# EasyEDA Pro project ProPrj_FK407M3-VET6-V1.1-LCD-EB_2024-10-31.epro

# Schematic Schematic1
Board Name: Board1; Create Date: 2024-10-30; Page Name: P1; Project Name: FK407M3-VET6-V1.1-LCD-EB; Schematic Name: Schematic1; Update Date: 2024-10-31; Company: 华北理工大学; Drawed: nayo; Page Size: A4; Reviewed: nayo; Version: V1.0
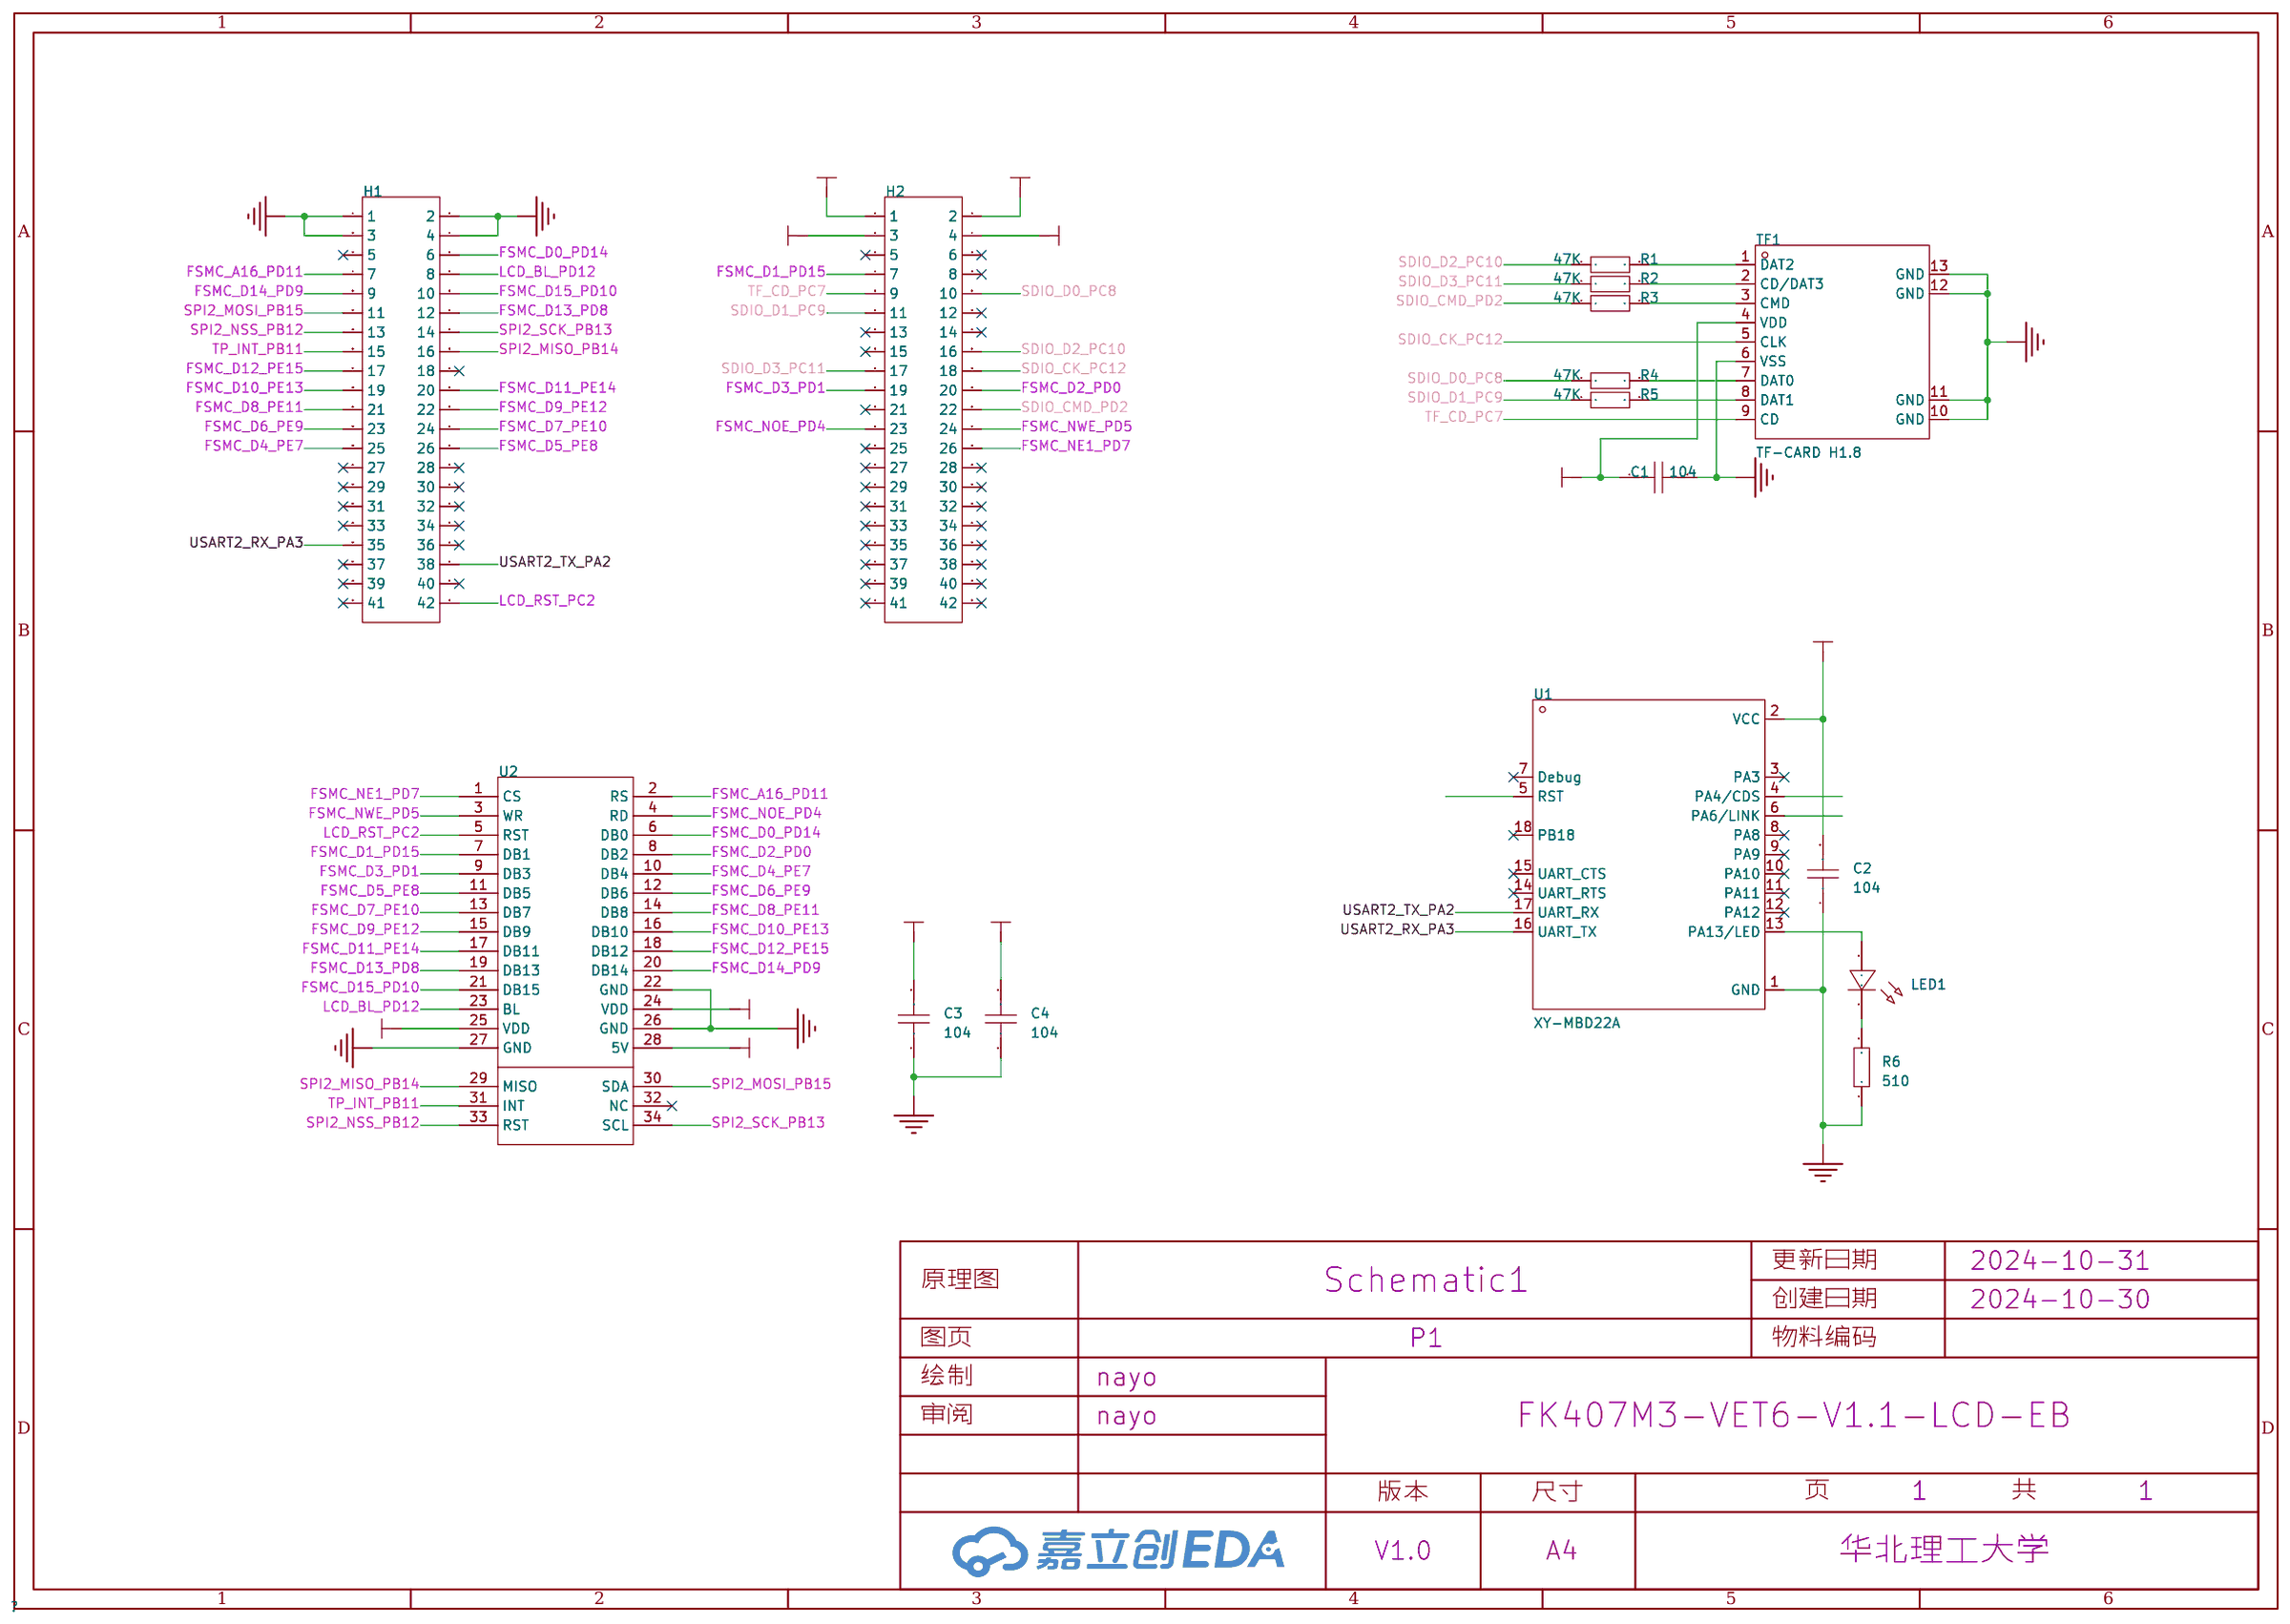
[diagram p0: schematic sheet]

## Parts
C1  104  [C0603]
C2  104  [C0603]
C3  104  [C0603]
C4  104  [C0603]
H1  -  [HDR-F_2.54_2x21P]
H2  -  [HDR-F_2.54_2x21P]
LED1  -  [LED_0603]
R1  47K  [R0603]
R2  47K  [R0603]
R3  47K  [R0603]
R4  47K  [R0603]
R5  47K  [R0603]
R6  510  [R0603]
TF1  TF-CARD H1.8  [TF-SMD_TF-CARD-H1.8]
U1  XY-MBD22A  [wirelm-smd_xy-mbd22a]
U2  -  [耀元鸿3.5寸TFT液晶显示屏并口串口电阻屏5点电容屏GT911彩屏LCD-加上挖槽]

## Library data of the parts
C1-C4 = CAP_0603: Supplier Footprint: 0603
H1 H2 = HDR-F_2.54_2x21P
LED1 = LED_0603-B: Supplier Footprint: 0603
R1-R6 = Res_0603: Supplier Footprint: 0603
TF1 = TF-CARD H1.8: 卡连接方式:自弹式;卡类型:MicroSD卡(TF卡);连接器类型:卡座;本体最大高度:1.8mm;触头材质:铜合金;触头镀层:金;工作温度范围:-40℃~+70℃;; LCSC Part Name: 自弹式 MicroSD卡(TF卡) 卡座; Supplier Part: C7529389; Manufacturer: SHOU HAN(首韩); Supplier Footprint: SMD; JLCPCB Part Class: 扩展库; Datasheet: https://atta.szlcsc.com/upload/public/pdf/source/20230818/611DB5E7B45C91025B0B37F957961A64.pdf; Supplier: LCSC; Card Connection Mode: 自弹式; Card Type: MicroSD卡(TF卡); Connector Type: 卡座; Maximum Body Height: 1.8mm; Contact Material: 铜合金; Contact Plating: 金; Operating Temperature Range: -40℃~+70℃
U1 = XY-MBD22A: Supplier Part: C9900138357; Supplier Footprint: 邮票孔; Supplier: LCSC
U2 = 耀元鸿3.5寸TFT液晶显示屏并口串口电阻屏5点电容屏GT911彩屏LCD

## Nets
3V3: C1.1 C2.2 C4.2 H2.3 H2.4 TF1.4(VDD) U1.2(VCC) U2.24(VDD) U2.25(VDD)
5V: C3.2 H2.1 H2.2 U2.28(5V)
GND: C1.2 C2.1 C3.1 C4.1 H1.1 H1.2 H1.3 H1.4 R6.1 TF1.6(VSS) TF1.10(GND) TF1.11(GND) TF1.12(GND) TF1.13(GND) U1.1(GND) U2.22(GND) U2.26(GND) U2.27(GND)
FSMC_A16_PD11: H1.7 U2.2(RS)
FSMC_D0_PD14: H1.6 U2.6(DB0)
FSMC_D1_PD15: H2.7 U2.7(DB1)
FSMC_D2_PD0: H2.20 U2.8(DB2)
FSMC_D3_PD1: H2.19 U2.9(DB3)
FSMC_D4_PE7: H1.25 U2.10(DB4)
FSMC_D5_PE8: H1.26 U2.11(DB5)
FSMC_D6_PE9: H1.23 U2.12(DB6)
FSMC_D7_PE10: H1.24 U2.13(DB7)
FSMC_D8_PE11: H1.21 U2.14(DB8)
FSMC_D9_PE12: H1.22 U2.15(DB9)
FSMC_D10_PE13: H1.19 U2.16(DB10)
FSMC_D11_PE14: H1.20 U2.17(DB11)
FSMC_D12_PE15: H1.17 U2.18(DB12)
FSMC_D13_PD8: H1.12 U2.19(DB13)
FSMC_D14_PD9: H1.9 U2.20(DB14)
FSMC_D15_PD10: H1.10 U2.21(DB15)
FSMC_NE1_PD7: H2.26 U2.1(CS)
FSMC_NOE_PD4: H2.23 U2.4(RD)
FSMC_NWE_PD5: H2.24 U2.3(WR)
LCD_BL_PD12: H1.8 U2.23(BL)
LCD_RST_PC2: H1.42 U2.5(RST)
SDIO_CK_PC12: H2.18 TF1.5(CLK)
SDIO_CMD_PD2: H2.22 R3.1
SDIO_D0_PC8: H2.10 R4.1
SDIO_D1_PC9: H2.11 R5.1
SDIO_D2_PC10: H2.16 R1.1
SDIO_D3_PC11: H2.17 R2.1
SPI2_MISO_PB14: H1.16 U2.29(MISO)
SPI2_MOSI_PB15: H1.11 U2.30(SDA)
SPI2_NSS_PB12: H1.13 U2.33(RST)
SPI2_SCK_PB13: H1.14 U2.34(SCL)
TF_CD_PC7: H2.9 TF1.9(CD)
TP_INT_PB11: H1.15 U2.31(INT)
USART2_RX_PA3: H1.35 U1.16(UART_TX)
USART2_TX_PA2: H1.38 U1.17(UART_RX)
Net-(LED1-1): LED1.1(C) R6.2
Net-(LED1-2): LED1.2(A) U1.13(PA13/LED)
Net-(R1-2): R1.2 TF1.1(DAT2)
Net-(R2-2): R2.2 TF1.2(CD/DAT3)
Net-(R3-2): R3.2 TF1.3(CMD)
Net-(R4-2): R4.2 TF1.7(DAT0)
Net-(R5-2): R5.2 TF1.8(DAT1)

Not connected (* = marked no-connect by the designer): H1 5* 18* 27* 28* 29* 30* 31* 32* 33* 34* 36* 37* 39* 40* 41*; H2 5* 6* 8* 12* 13* 14* 15* 21* 25* 27* 28* 29* 30* 31* 32* 33* 34* 35* 36* 37* 38* 39* 40* 41* 42*; U1 3(PA3)* 4(PA4/CDS) 5(RST) 6(PA6/LINK) 7(Debug)* 8(PA8)* 9(PA9)* 10(PA10)* 11(PA11)* 12(PA12)* 14(UART_RTS)* 15(UART_CTS)* 18(PB18)*; U2 32(NC)*

# Board PCB1
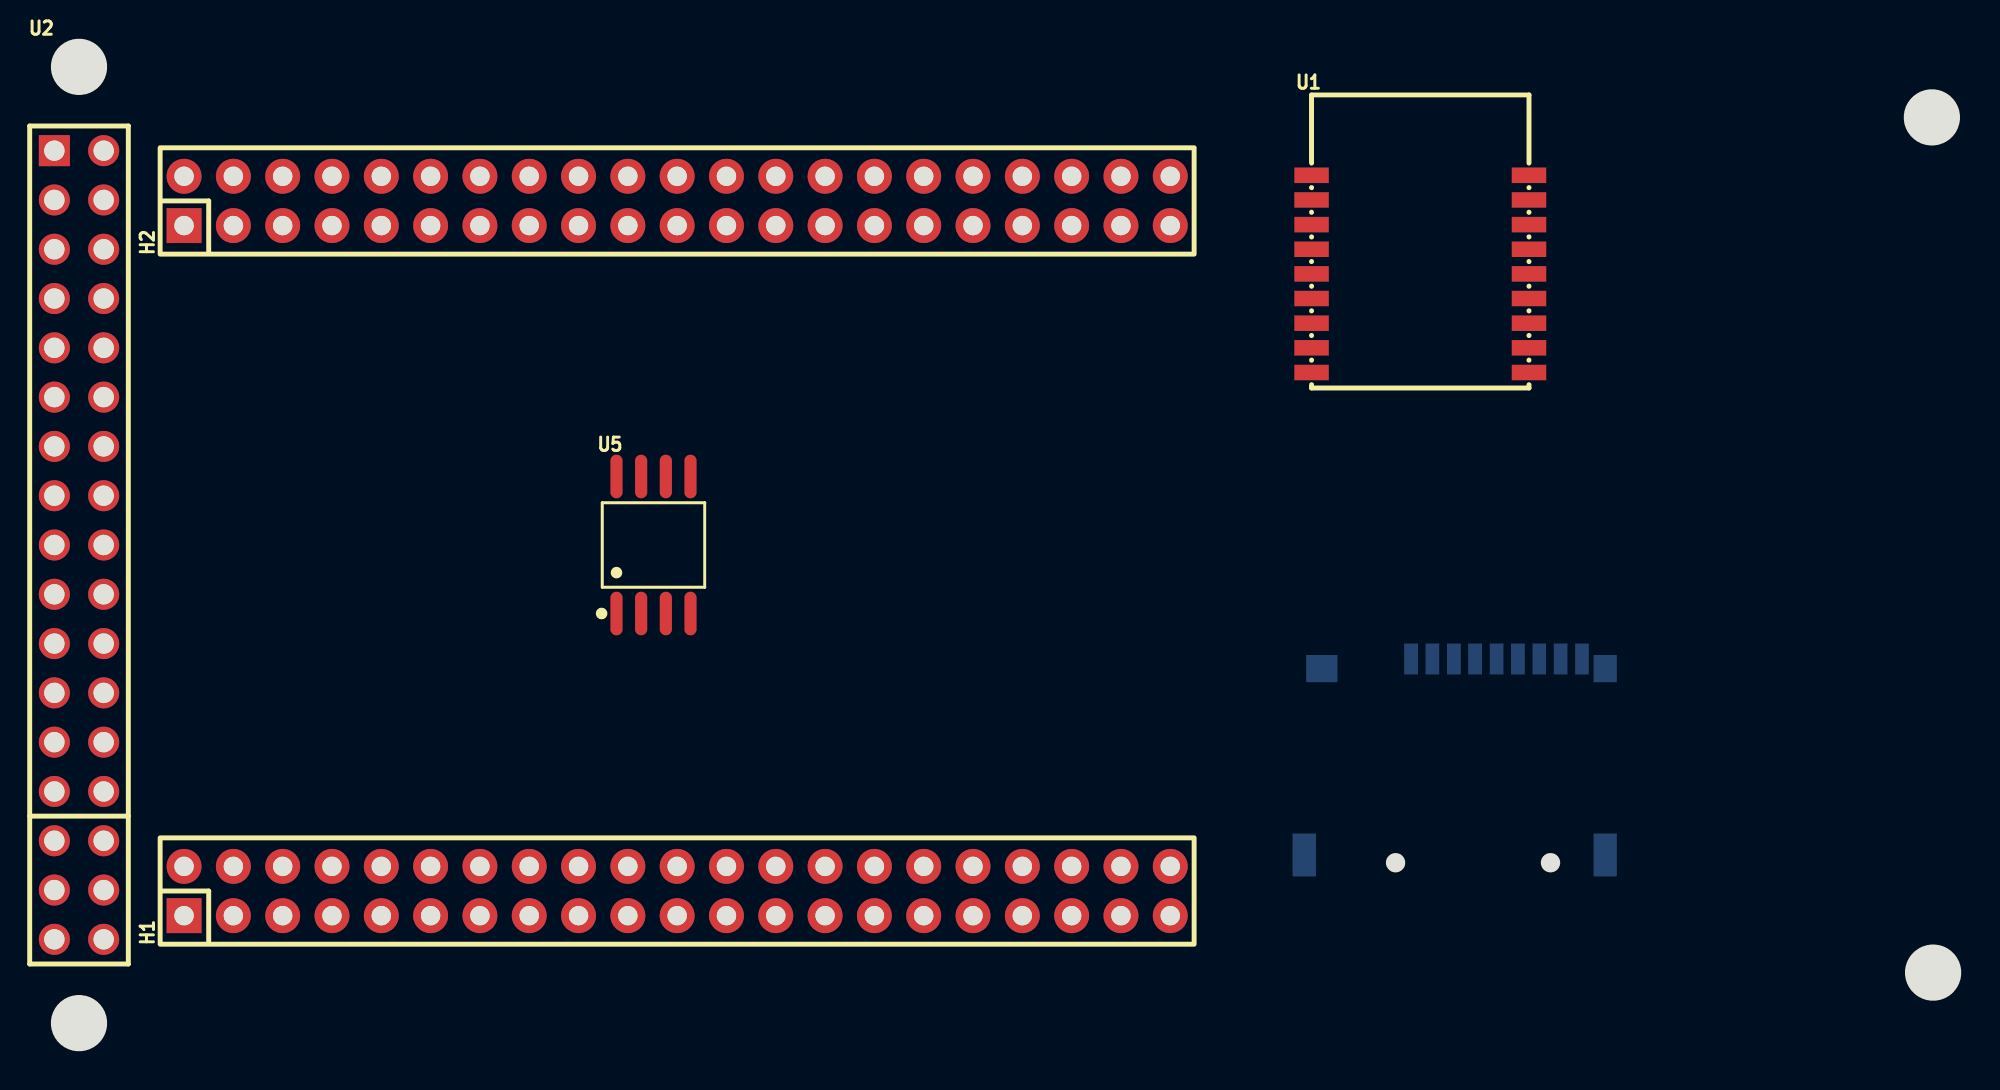
[diagram p1: board, top side]
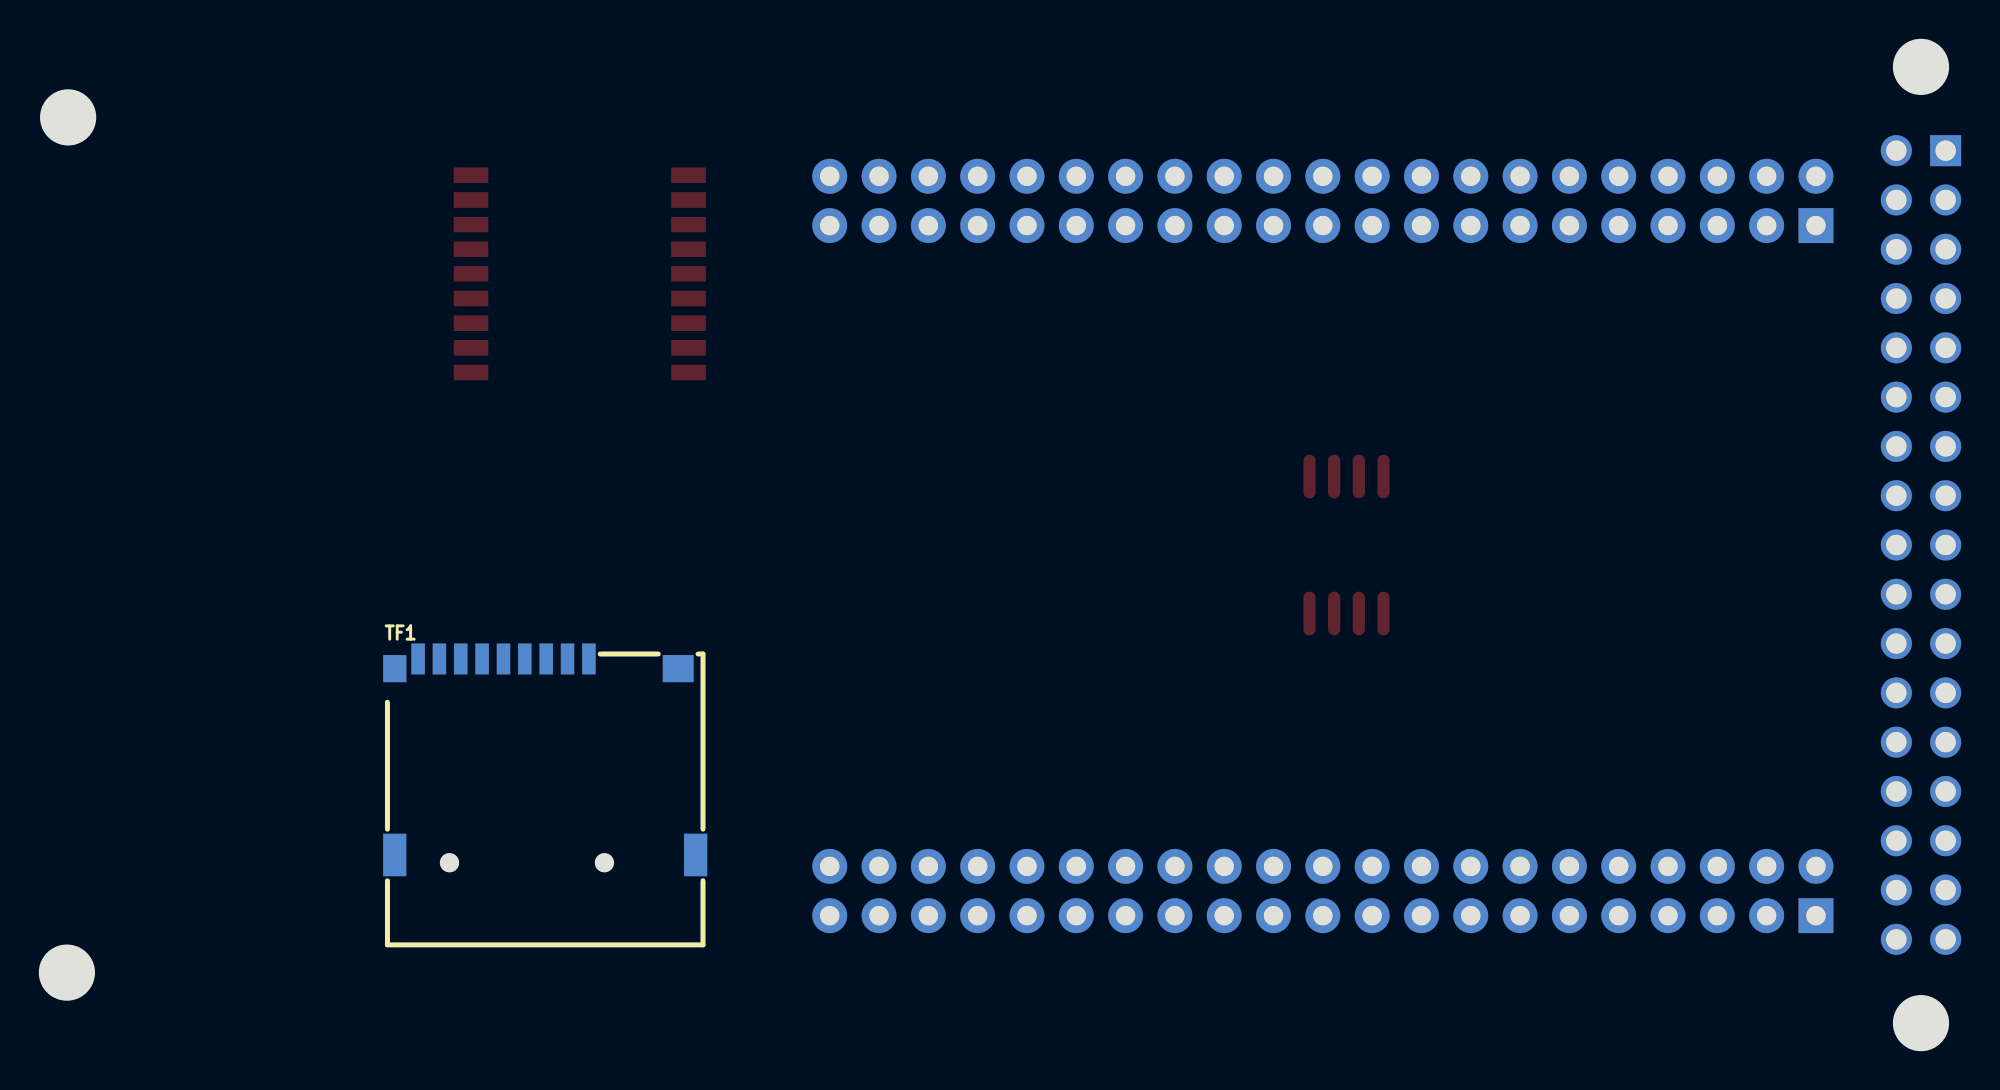
[diagram p2: board, bottom side, seen from below]

Outline 98.4 x 52.17 mm; copper layers: Top Layer, Bottom Layer. Coordinates in mm from the lower left corner of the outline.
Stack: Top Layer 0.035mm / Dielectric1 1.51mm FR4 er 4.5 / Bottom Layer 0.035mm

## Design rules (mm)
template: JLCPCB Capability(Two Layers Board)
spacing copperThickness1oz (default): track to track 0.102, other pairs 0.152 to 0.3
spacing copperThickness2oz: track to track 0.203, other pairs 0.152 to 0.3
track width copperThickness1oz (default): min 0.127, default 0.254, max 2.54
track width copperThickness2oz: min 0.203, default 0.254, max 2.54
differential pair differentialPair (default): width min 0.127, default 0.254, max 2.54; gap min 0.152, default 0.152
via viaSize (default): diameter min 0.5, default 0.61, max 10; hole min 0.3, default 0.305, max 6.3

## Placement (name value [footprint] x y rotation side)
H1  -  [HDR-F_2.54_2x21P]  8.13 8.25 90 top
H2  -  [HDR-F_2.54_2x21P]  8.13 43.81 90 top
TF1  TF-CARD H1.8  [TF-SMD_TF-CARD-H1.8]  72.31 15.16 180 bottom
U1  XY-MBD22A  [wirelm-smd_xy-mbd22a]  70.53 40.05 0 top
U2  -  [耀元鸿3.5寸TFT液晶显示屏并口串口电阻屏5点电容屏GT911彩屏LCD-加上挖槽]  -1.09 47.67 0 top
U5  W25Q64JVSSIQ  [SOIC-8_L5.3-W5.3-P1.27-LS8.0-BL]  31.04 26.08 0 top

## Footprints (pads in the part's own frame, mm; a bottom-side part is the same pattern mirrored in y, then rotated)
HDR-F_2.54_2x21P
  rect 1.8x1.8 hole 1: 1(-1.27,1.27)
  round 1.8 hole 1: 2(1.27,1.27) 3(-1.27,-1.27) 4(1.27,-1.27) 5(-1.27,-3.811) 6(1.27,-3.811) 7(-1.27,-6.351) 8(1.27,-6.351) 9(-1.27,-8.89) 10(1.27,-8.89) 11(-1.27,-11.431) 12(1.27,-11.431) 13(-1.27,-13.97) 14(1.27,-13.97) 15(-1.27,-16.511) 16(1.27,-16.511) 17(-1.27,-19.05) 18(1.27,-19.05) 19(-1.27,-21.59) 20(1.27,-21.59) 21(-1.27,-24.131) 22(1.27,-24.131) 23(-1.27,-26.671) 24(1.27,-26.671) 25(-1.27,-29.21) 26(1.27,-29.21) 27(-1.27,-31.75) 28(1.27,-31.75) 29(-1.27,-34.291) 30(1.27,-34.291) 31(-1.27,-36.831) 32(1.27,-36.831) 33(-1.27,-39.37) 34(1.27,-39.37) 35(-1.27,-41.91) 36(1.27,-41.91) 37(-1.27,-44.45) 38(1.27,-44.45) 39(-1.27,-46.99) 40(1.27,-46.99) 41(-1.27,-49.531) 42(1.27,-49.531)
SOIC-8_L5.3-W5.3-P1.27-LS8.0-BL
  oval 0.63x2.25 smd: 1(-1.905,-3.53) 2(-0.635,-3.53) 3(0.635,-3.53) 4(1.905,-3.53) 5(1.905,3.53) 6(0.635,3.53) 7(-0.635,3.53) 8(-1.905,3.53)
TF-SMD_TF-CARD-H1.8
  rect 0.7x1.6 smd: 1(2.25,5.05) 2(1.15,5.05) 3(0.05,5.05) 4(-1.05,5.05) 5(-2.15,5.05) 6(-3.25,5.05) 7(-4.35,5.05) 8(-5.45,5.05) 9(-6.55,5.05)
  rect 1.2x1.4 smd: 10(-7.747,4.55)
  rect 1.2x2.2 smd: 11(-7.75,-5.05) 12(7.75,-5.05)
  rect 1.6x1.4 smd: 13(6.85,4.55)
wirelm-smd_xy-mbd22a
  rect 1.778x0.8 smd: 1(-5.6,5.08) 2(-5.6,3.81) 3(-5.6,2.54) 4(-5.6,1.27) 5(-5.6,0) 6(-5.6,-1.27) 7(-5.6,-2.54) 8(-5.6,-3.81) 9(-5.6,-5.08) 10(5.6,-5.08) 11(5.6,-3.81) 12(5.6,-2.54) 13(5.6,-1.27) 14(5.6,0) 15(5.6,1.27) 16(5.6,2.54) 17(5.6,3.81) 18(5.6,5.08)
耀元鸿3.5寸TFT液晶显示屏并口串口电阻屏5点电容屏GT911彩屏LCD-加上挖槽
  rect 1.6x1.6 hole 1.05: 1(1.27,-1.27)
  round 1.6 hole 1.05: 2(3.81,-1.27) 3(1.27,-3.81) 4(3.81,-3.81) 5(1.27,-6.35) 6(3.81,-6.35) 7(1.27,-8.89) 8(3.81,-8.89) 9(1.27,-11.43) 10(3.81,-11.43) 11(1.27,-13.97) 12(3.81,-13.97) 13(1.27,-16.51) 14(3.81,-16.51) 15(1.27,-19.05) 16(3.81,-19.05) 17(1.27,-21.59) 18(3.81,-21.59) 19(1.27,-24.13) 20(3.81,-24.13) 21(1.27,-26.67) 22(3.81,-26.67) 23(1.27,-29.21) 24(3.81,-29.21) 25(1.27,-31.75) 26(3.81,-31.75) 27(1.27,-34.29) 28(3.81,-34.29) 29(1.27,-36.83) 30(3.81,-36.83) 31(1.27,-39.37) 32(3.81,-39.37) 33(1.27,-41.91) 34(3.81,-41.91)

## Nets
3V3: H2.3 H2.4
5V: H2.1 H2.2
GND: H1.1 H1.2 H1.3 H1.4
FSMC_D0_PD14: H1.6
FSMC_D1_PD15: H2.7
FSMC_D2_PD0: H2.20
FSMC_D3_PD1: H2.19 U2.9
FSMC_NE1_PD7: H2.26
FSMC_NOE_PD4: H2.23
FSMC_NWE_PD5: H2.24
$1N2634: U2.6
$1N2638: U2.8
$1N2643: U2.10
$1N2648: U2.12
$1N2653: U2.14
$1N2658: U2.16
$1N2663: U2.18
$1N2668: U2.20
$1N2673: U2.21
$1N2678: U2.19
$1N2683: U2.17
$1N2688: U2.15
$1N2693: U2.13
$1N2698: U2.11
$1N2713: U2.7

Pads without a net: H1 5 7 8 9 10 11 12 13 14 15 16 17 18 19 20 21 22 23 24 25 26 27 28 29 30 31 32 33 34 35 36 37 38 39 40 41 42; H2 5 6 8 9 10 11 12 13 14 15 16 17 18 21 22 25 27 28 29 30 31 32 33 34 35 36 37 38 39 40 41 42; TF1 1 2 3 4 5 6 7 8 9 10 11 12 13; U1 1 2 3 4 5 6 7 8 9 10 11 12 13 14 15 16 17 18; U2 1 2 3 4 5 22 23 24 25 26 27 28 29 30 31 32 33 34; U5 1 2 3 4 5 6 7 8
